# Altium schematic sheet 电源模块原理图.SchDoc
size A4
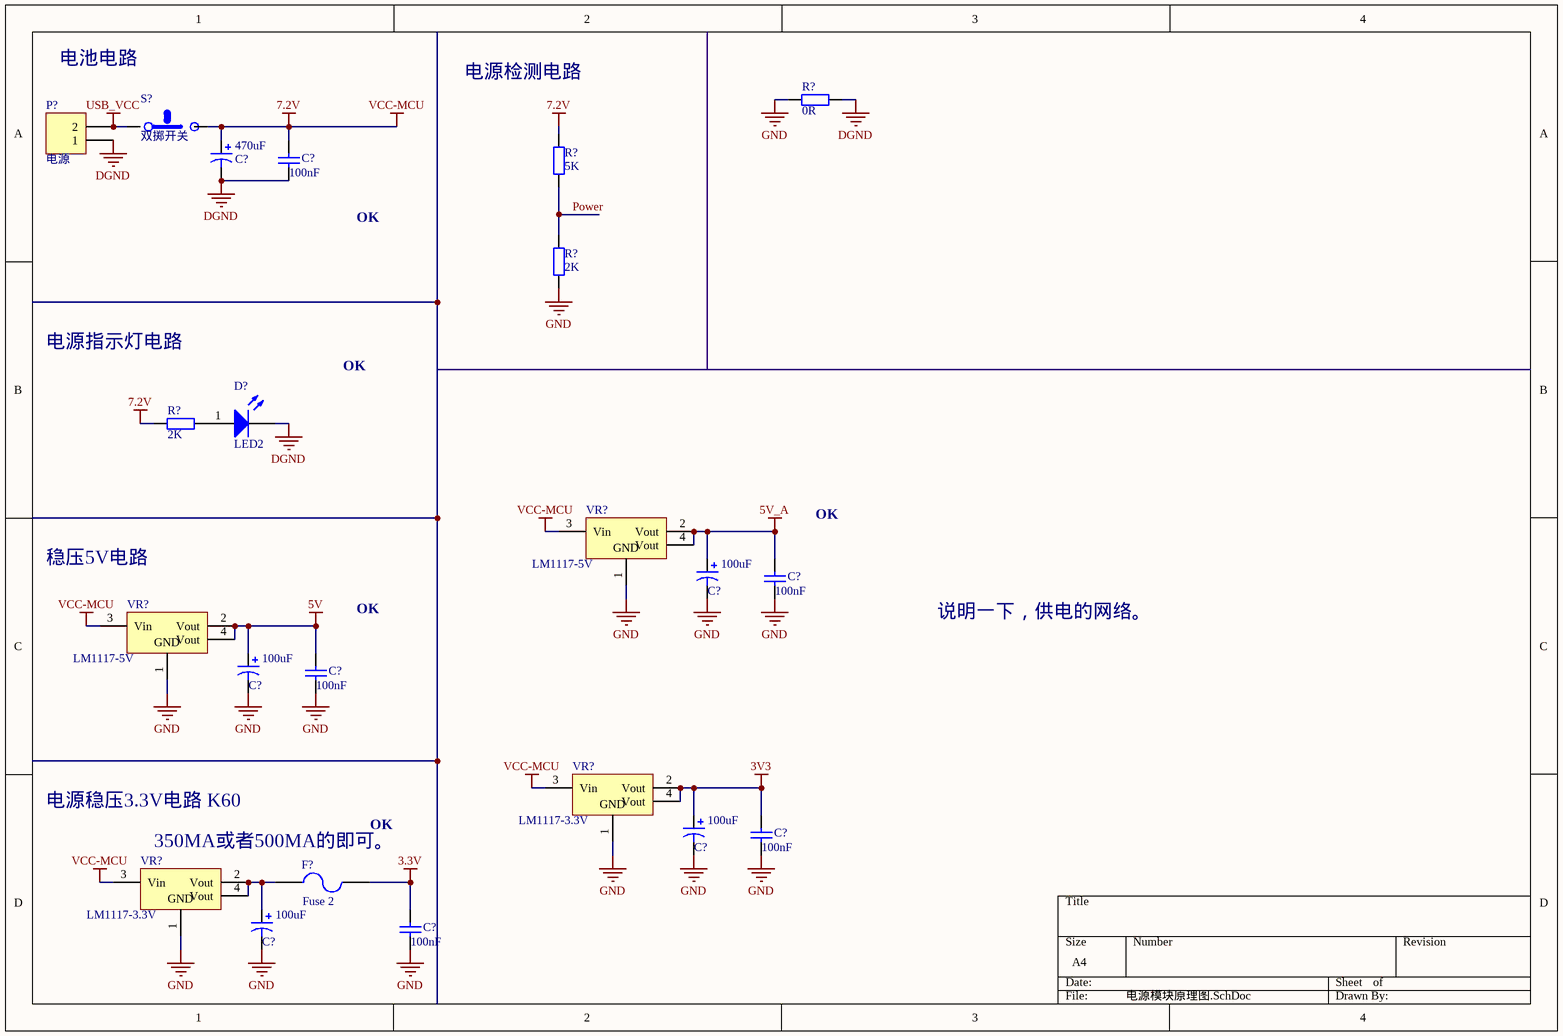
[diagram p0: 电源模块原理图.SchDoc]

## Parts
(Parts that share a designator on the sheet are numbered #1, #2 ... from top to bottom, then left to right.)
C?#1  470uF  [470uF]
C?#2  value 100nF  [C0603]  (hidden comment: Cap)
C?#3  100uF  [正负电容]
C?#4  value 100nF  [C0603]  (hidden comment: Cap)
C?#5  100uF  [正负电容]
C?#6  value 100nF  [C0603]  (hidden comment: Cap)
C?#7  100uF  [正负电容]
C?#8  value 100nF  [C0603]  (hidden comment: Cap)
C?#9  100uF  [正负电容]
C?#10  value 100nF  [C0603]  (hidden comment: Cap)
D?  LED2  [LED-0805 - duplicate]
F?  Fuse 2  [贴片保险丝]
P?  电源  [7.2V]
R?#1  value 0R  [R0603]  (hidden comment: Res2)
R?#2  value 5K  [R0603]  (hidden comment: Res2)
R?#3  value 2K  [R0603]  (hidden comment: Res2)
R?#4  value 2K  [R0603]  (hidden comment: Res2)
S?  双掷开关  [总开关]
VR?#1  LM1117-5V  [SOT223]
VR?#2  LM1117-5V  [SOT223]
VR?#3  LM1117-3.3V  [SOT223]
VR?#4  LM1117-3.3V  [SOT223]

## Nets
3.3V: C?#10.1 F?.2
3V3: C?#7.1 C?#8.1 VR?#3.2(Vout) VR?#3.4(Vout)
5V: C?#5.1 C?#6.1 VR?#2.2(Vout) VR?#2.4(Vout)
5V_A: C?#3.1 C?#4.1 VR?#1.2(Vout) VR?#1.4(Vout)
7.2V: C?#1.1 C?#2.1 R?#2.2 R?#4.2 S?.2 VR?#1.3(Vin) VR?#2.3(Vin) VR?#3.3(Vin) VR?#4.3(Vin)  [also labelled VCC-MCU]
DGND: C?#1.2 C?#2.2 D?.2(K) P?.1 R?#1.1
GND: C?#3.2 C?#4.2 C?#5.2 C?#6.2 C?#7.2 C?#8.2 C?#9.2 C?#10.2 R?#1.2 R?#3.1 VR?#1.1(GND) VR?#2.1(GND) VR?#3.1(GND) VR?#4.1(GND)
USB_VCC: P?.2 S?.1
Power: R?#2.1 R?#3.2
NetC?#9_1: C?#9.1 F?.1 VR?#4.2(Vout) VR?#4.4(Vout)
NetD?_1: D?.1(A) R?#4.1

## Notes on the sheet
- 电池电路
- 电源检测电路
- OK
- 电源指示灯电路
- 稳压5V电路
- 说明一下，供电的网络。
- 电源稳压3.3V电路 K60
- 350MA或者500MA的即可。

## Library data of the parts
C?#1 C?#3 C?#5 C?#7 C?#9 = Cap Pol1: Polarized Capacitor (Radial); Published: 8-Jun-2000; LatestRevisionDate: 17-Jul-2002; LatestRevisionNote: Re-released for DXP Platform.; PackageReference: RB7.6-15; Publisher: Altium Limited
C?#2 C?#4 C?#6 C?#8 C?#10 = Cap: Capacitor; Published: 8-Jun-2000; LatestRevisionDate: 17-Jul-2002; LatestRevisionNote: Re-released for DXP Platform.; PackageReference: RAD-0.3; Publisher: Altium Limited
D? = LED2: Typical RED, GREEN, YELLOW, AMBER GaAs LED; Published: 8-Jun-2000; LatestRevisionDate: 17-Jul-2002; LatestRevisionNote: Re-released for DXP Platform.; PackageDocument: Feb-2002; PackageReference: 3.2X1.6X1.1; Publisher: Altium Limited
F? = Fuse 2: Fuse; Published: 8-Jun-2000; LatestRevisionDate: 17-Jul-2002; LatestRevisionNote: Re-released for DXP Platform.; PackageReference: PIN-W2/E2.8; Publisher: Altium Limited
P? = Header 2: Header, 2-Pin; LatestRevisionDate: 17-Jul-2002; LatestRevisionNote: Re-released for DXP Platform.; Publisher: Altium Limited
R?#1-R?#4 = Res2: Resistor; Published: 8-Jun-2000; LatestRevisionDate: 17-Jul-2002; LatestRevisionNote: Re-released for DXP Platform.; PackageReference: AXIAL-0.4; Publisher: Altium Limited
  R?#1-R?#3: PackageDescription: Axial Device, Thru-Hole; 2 Leads; 0.4 in Pin Spacing
VR?#1-VR?#4 = LM1117: Voltage Regulator; Published: 24-Mar-1999; LatestRevisionDate: 17-Jul-2002; LatestRevisionNote: Re-released for DXP Platform.; PackageReference: D2PAK; Publisher: Altium Limited; Code_JEDEC: SMD-220